# EAGLE design Schema1 (EAGLE 9.6.2)
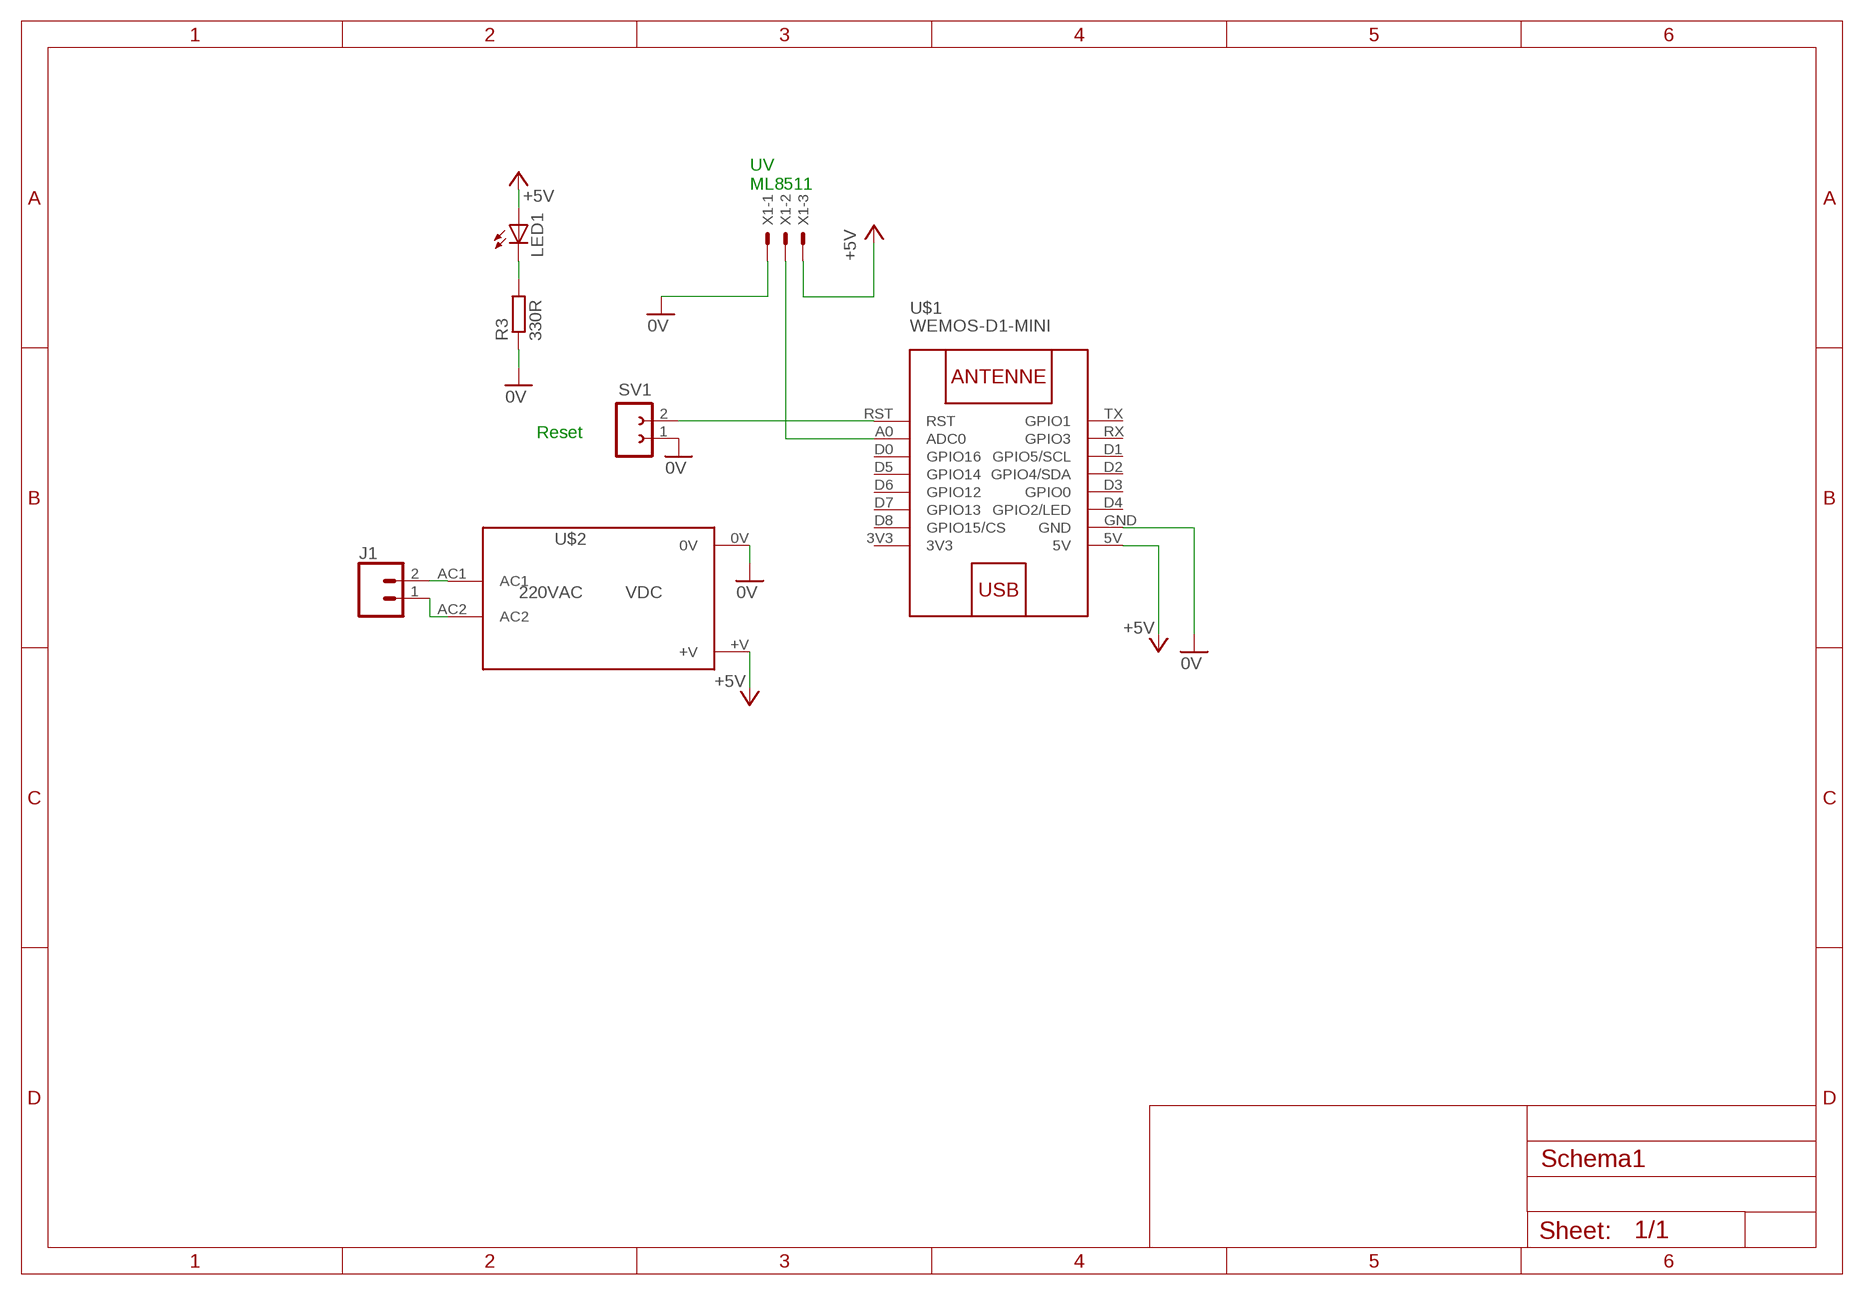
[diagram p0: schematic, sheet 1]

## Parts
J1  CONN_025MM  [BORNIER_A_VIS_2_5.12MM]
LED1  LED5MM_F  [LED5MM]
R3  330R  R-EU_0207/10  [0207/10]
SV1  FE02-1  [FE02-1]
U$1  WEMOS-D1-MINI  [WEMOS-D1-MINI]
U$2  TSP05-5V-3W  [TSP05-VDC-3W]
X1  JST-XH-03-PIN-LONG-PAD  [JST-XH-03-PACKAGE-LONG-PAD]

## Nets
0V: R3.1 SV1.1 U$1.GND U$2.0V X1.1
+5V: LED1.A U$1.5V U$2.+V X1.3
N$1: U$1.A0(ADC0) X1.2
N$2: J1.2 U$2.AC1
N$3: SV1.2 U$1.RST
N$7: J1.1 U$2.AC2
N$8: LED1.K(C) R3.2
Unconnected: U$1.D0(GPIO16) U$1.D1(GPIO5/SCL) U$1.D2(GPIO4/SDA) U$1.D3(GPIO0) U$1.D4(GPIO2/LED) U$1.D5(GPIO14) U$1.D6(GPIO12) U$1.D7(GPIO13) U$1.D8(GPIO15/CS) U$1.RX(GPIO3) U$1.TX(GPIO1)

## Notes on the sheet
- UV
  ML8511
- Reset

## Power pins joined to a net without a drawn wire
3V3: U$1.3V3

## Library data of the parts
J1 = 04_Remy:CONN_02: Multi connection point. Often used as Generic Header-pin footprint for 0.1 inch spaced/style header connections On any of the 0.1 inch spaced packages, you can populate with these: Break Away Headers - Straight <https://www.sparkfun.com/products/116> (PRT-00116) Break Away Male Headers - Right Angle <https://www.sparkfun.com/products/553> (PRT-00553) Female Headers <https://www.sparkfun.com/products/115> (PRT-00115) Break Away Headers - Machine Pin <https://www.sparkfun.com/products/117> (PRT-00117) Break Away Female Headers - Swiss Machine Pin <https://www.sparkfun.com/products/743> (PRT-00743) For SCREWTERMINALS and SPRING TERMINALS visit here: Screw Terimnals on SparkFun.com <https://www.sparkfun.com/search/results?term=Screw+Terminals> (5mm/3.5mm/2.54mm spacing) This device is also useful as a general connection point to wire up your design to another part of your project. Our various solder wires solder well into these plated through hole pads. Hook-Up Wire - Assortment (Stranded, 22 AWG) <https://www.sparkfun.com/products/11375> (PRT-11375) Hook-Up Wire - Assortment (Solid Core, 22 AWG) <https://www.sparkfun.com/products/11367> (PRT-11367) View the entire wire category on our website here <https://www.sparkfun.com/categories/141> Special notes: Molex polarized connector foot print use with: PRT-08233 with associated crimp pins and housings. 2.54_SCREWTERM for use with PRT-10571. 3.5mm Screw Terminal footprints for PRT-08084 5mm Screw Terminal footprints for use with PRT-08432; SF_SKU: PRT-08432
LED1 = 04_Remy:LED: LEDS
R3 = 04_Remy:R-EU_: RESISTOR, European symbol
SV1 = 02-con-lsta-F:FE02-1: FEMALE HEADER
U$1 = _Remy:WEMOS-D1-MINI: WEMOS D1 mini: Mini Wi-Fi Board based on ESP-8266 device More details can be found here: https://www.wemos.cc/product/d1-mini.html Click here to find device on ebay.com <http://www.ebay.com/sch/wemos+d1+mini+nodemcu>
U$2 = 04_Remy:TSP05-5V-3W
X1 = con-JST XH Connectors v1-0:JST-XH-03-PIN: JST XH Connector 2 Pin Wire to board connector. Pitch: 2,54 mm, (0.100") Number of pins: 3 Created by Rembrandt Electronics www.rembrandtelectronics.com

## Board
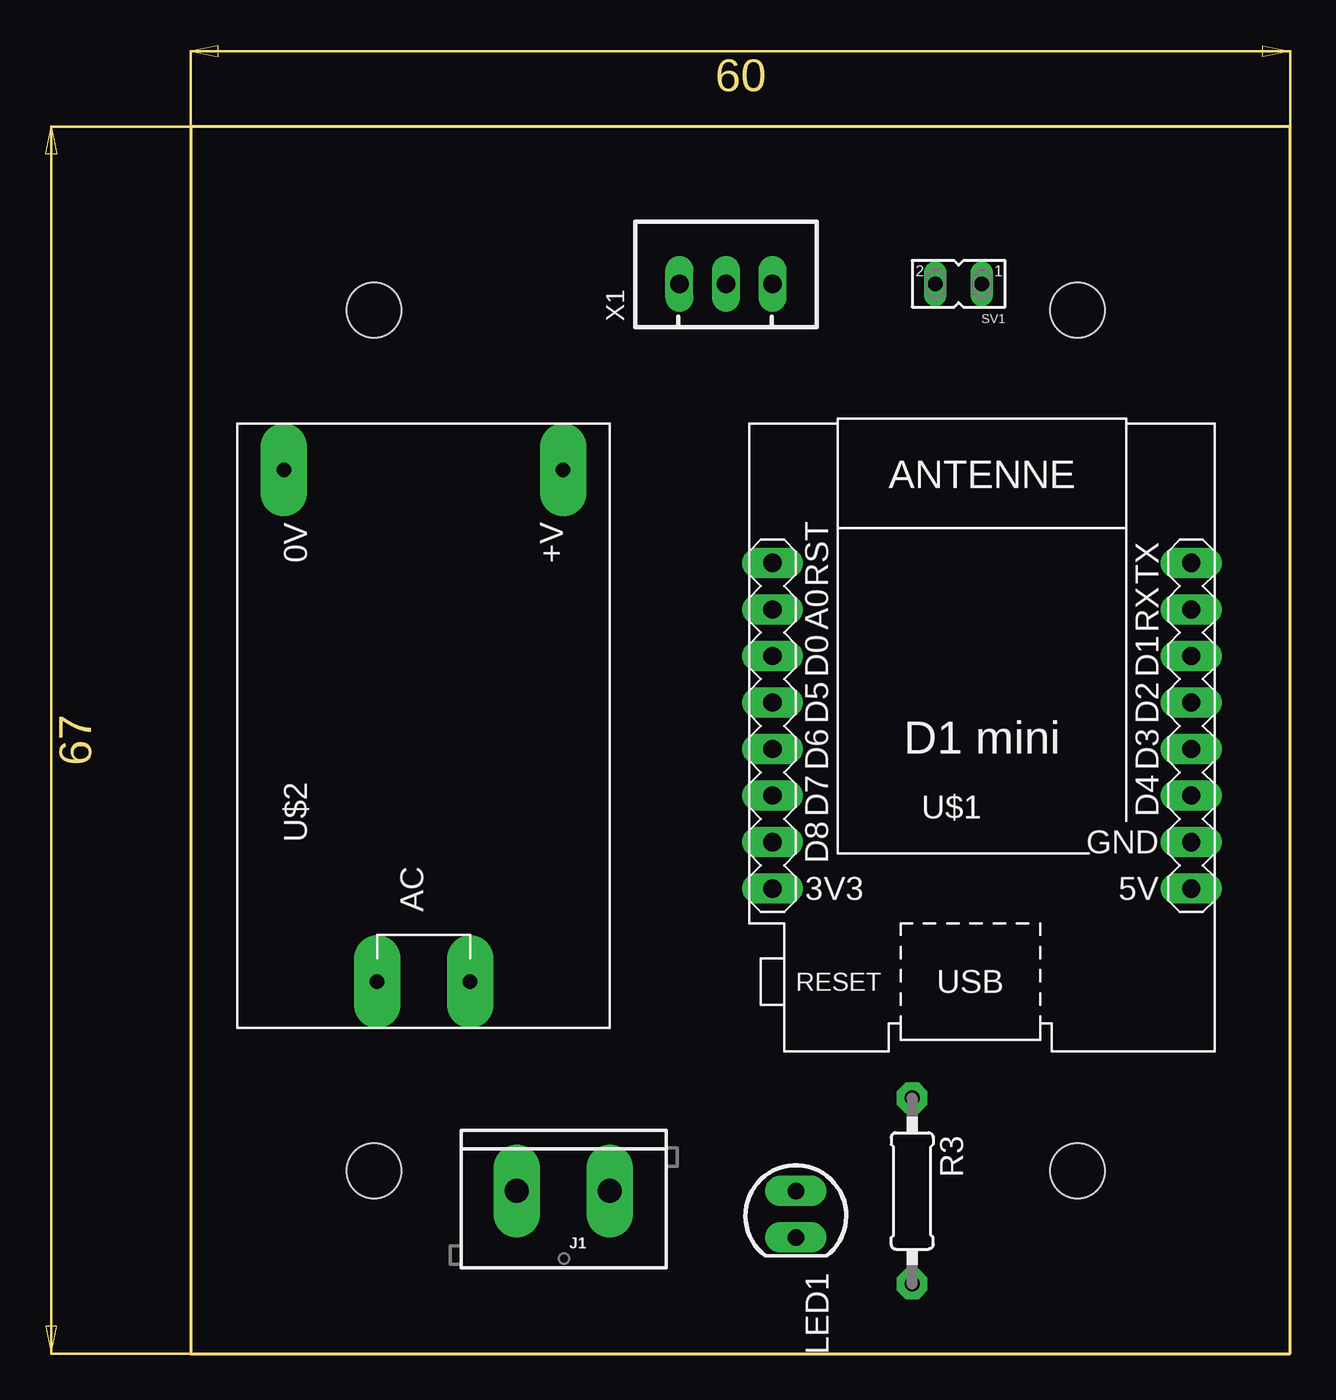
[diagram p1: board, top side]
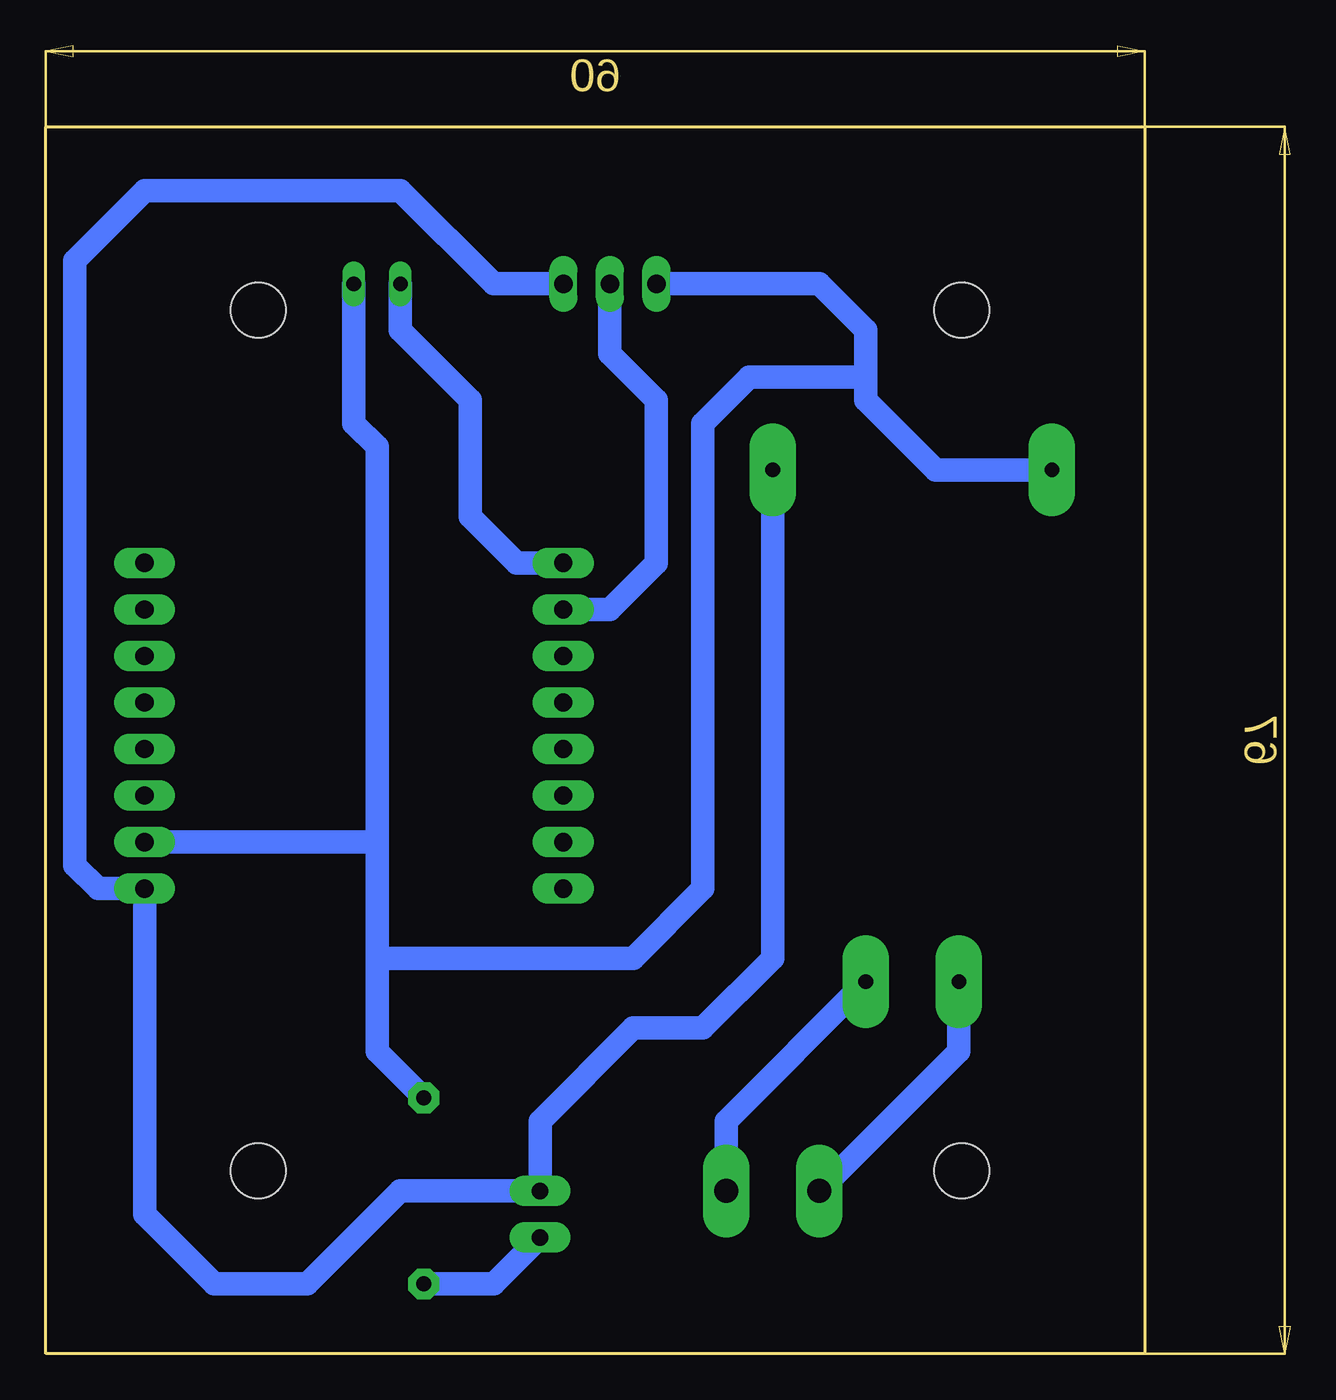
[diagram p2: board, bottom side, seen from below]

Size 60 x 67 mm. Coordinates in mm from the lower left corner, seen from the top.
Outline: 0,67 0,0 60,0 60,67 0,67
Copper layers (1*16): Top 0.035mm / dielectric 0.15mm / Bottom 0.035mm
Design rules "FastGcode-DesignRules": minimum track width 6mil, minimum drill 0.35mm, track to track 6mil, track to pad 6mil, pad to pad 6mil, via to via 6mil, smd to smd 6mil, copper to edge 31mil, drill to drill 6mil, minimum pad ring 5mil, minimum via ring 8mil, stop-mask expansion 4mil, vias tented up to drill 0mil, thermal gap 47mil
Holes 3 mm at 10,9.99 48.4,9.99 48.4,56.99 10,56.99

### Footprints (pad centres in the part's own frame; a part is rotated, then mirrored left to right if it is on the bottom)
BORNIER_A_VIS_2_5.12MM = drill 1.3 pad 2.54 long: 1 -2.54,0; 2 2.54,0
LED5MM = drill 0.9 pad 1.676 long: A -1.27,0; K 1.27,0
0207/10 = drill 0.813 pad 1.676 octagon: 1 -5.08,0; 2 5.08,0
FE02-1 = drill 0.813 long: 1 -1.27,0; 2 1.27,0
WEMOS-D1-MINI = drill 1 pad 1.676 long: 3V3 -11.43,-7.62; 5V 11.43,-7.62; A0 -11.43,7.62; D0 -11.43,5.08; D1 11.43,5.08; D2 11.43,2.54; D3 11.43,0; D4 11.43,-2.54; D5 -11.43,2.54; D6 -11.43,0; D7 -11.43,-2.54; D8 -11.43,-5.08; GND 11.43,-5.08; RST -11.43,10.16; RX 11.43,7.62; TX 11.43,10.16
TSP05-VDC-3W = drill 0.8 pad 2.54 long: 0V 13.97,7.62; +V 13.97,-7.62; AC1 -13.97,2.54; AC2 -13.97,-2.54
JST-XH-03-PACKAGE-LONG-PAD = drill 1.016 long: 1 -2.54,0; 2 0,0; 3 2.54,0

### Placement (x,y rotation side)
J1  20.32,8.89 180 top
LED1  33.02,7.62 270 top
R3  39.37,8.89 270 top
SV1  41.91,58.42 180 top
U$1  43.18,33.02 0 top
U$2  12.7,34.29 90 top
X1  29.21,58.42 0 top

### Tracks (layer width: path | path; a pad name or v marks a point on that pad's centre or on a via)
0V
  Bottom 1.27: R3.1 41.91,16.51 41.91,21.59 | 41.91,27.94 41.91,25.4 41.91,21.59 | U$1.GND 44.45,27.94 41.91,27.94 | 15.24,53.34 15.24,55.88 17.78,58.42 X1.1 | 15.24,53.34 15.24,52.07 11.43,48.26 U$2.0V | SV1.1 43.18,50.8 41.91,49.53 41.91,27.94 | 15.24,53.34 21.59,53.34 24.13,50.8 24.13,25.4 27.94,21.59 41.91,21.59
+5V
  Bottom 1.27: X1.3 35.56,58.42 40.64,63.5 54.61,63.5 58.42,59.69 58.42,26.67 57.15,25.4 U$1.5V 54.61,7.62 50.8,3.81 45.72,3.81 40.64,8.89 LED1.A 33.02,12.7 27.94,17.78 24.13,17.78 20.32,21.59 U$2.+V
N$1
  Bottom 1.27: X1.2 29.21,54.61 26.67,52.07 26.67,43.18 29.21,40.64 U$1.A0
N$2
  Bottom 1.27: J1.2 10.16,16.51 U$2.AC1
N$3
  Bottom 1.27: SV1.2 40.64,55.88 36.83,52.07 36.83,45.72 34.29,43.18 U$1.RST
N$7
  Bottom 1.27: J1.1 22.86,10.16 22.86,12.7 U$2.AC2
N$8
  Bottom 1.27: LED1.K 35.56,3.81 R3.2